# Altium project PCB_Moteur_ofa.PrjPcb
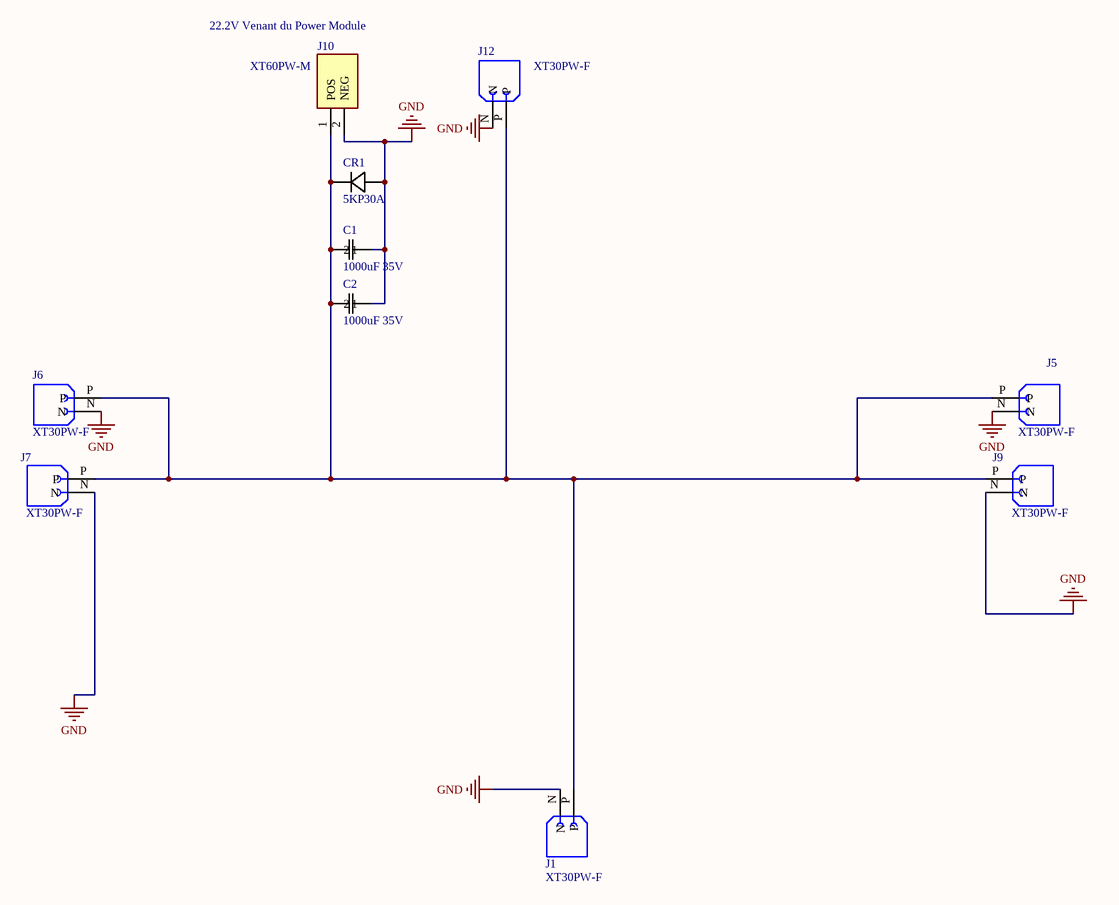
[diagram p0: SCHEM_MOTEUR_PDB_OFA.SchDoc]
1 sheet, 10 parts. Net scope: global (net labels, ports and power ports of the same name join across sheets).
Board file: PCB_moteur.PcbDoc

## Sheet SCHEM_MOTEUR_PDB_OFA.SchDoc
size 381 x 241 mm; SheetNumber: 1; SheetTotal: 1

### Parts
C1  1000uF 35V  [CAP_RX_12P5X25_RUB]
C2  1000uF 35V  [CAP_RX_12P5X25_RUB]
CR1  5KP30A  [DIODE_P600_VIS]
J1  XT30PW-F  [AMASS_XT30PW-F]
J5  XT30PW-F  [AMASS_XT30PW-F]
J6  XT30PW-F  [AMASS_XT30PW-F]
J7  XT30PW-F  [AMASS_XT30PW-F]
J9  XT30PW-F  [AMASS_XT30PW-F]
J10  XT60PW-M  [AMASS_XT60PW-M]
J12  XT30PW-F  [AMASS_XT30PW-F]

### Nets
GND: C1.2 C2.2 CR1.2 J1.N J5.N J6.N J7.N J9.N J10.2(NEG) J12.N
NetC1_1: C1.1 C2.1 CR1.1 J1.P J5.P J6.P J7.P J9.P J10.1(POS) J12.P

### Notes on the sheet
- 22.2V Venant du Power Module

### Library data of the parts
C1 C2 = 35RX301000M12.5X25: Manufacturer_Name: Rubycon; Copyright: Copyright (C) 2026 Ultra Librarian. All rights reserved.; Manufacturer_Part_Number: 35RX301000M12.5X25
CR1 = 5KP30A: Description; Manufacturer_Name: Vishay; Copyright: Copyright (C) 2026 Ultra Librarian. All rights reserved.; Manufacturer_Part_Number: 5KP30A
J1 J5-J7 J9 J12 = XT30PW-F: Socket; DC supply; XT30; female; PIN: 2; on PCBs; THT; yellow; 15A; MF: amass; SnapEDA_Link: https://www.snapeda.com/parts/XT30PW-F/AMASS/view-part/?ref=snap; Package: None; Value: *; MP: XT30PW-F; Check_prices: https://www.snapeda.com/parts/XT30PW-F/AMASS/view-part/?ref=eda
J10 = XT60PW-M: Socket, DC supply, male, PIN: 2; MF: AMASS; Check_prices: https://www.snapeda.com/parts/XT60PW-M/AMASS/view-part/?ref=eda; SnapEDA_Link: https://www.snapeda.com/parts/XT60PW-M/AMASS/view-part/?ref=snap; Price: None; Availability: Not in stock; Package: Package; MP: XT60PW-M; Value: *